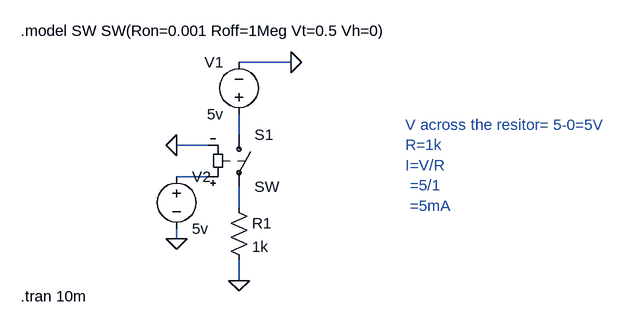
[diagram p0: schematic SW A(series).asc]
SW A(series).asc, the LTspice schematic file:
Version 4.1
SHEET 1 880 680
WIRE 288 -320 208 -320
WIRE 208 -208 208 -240
WIRE 160 -192 112 -192
WIRE 160 -144 112 -144
WIRE 208 -96 208 -128
WIRE 112 -48 112 -64
WIRE 208 16 208 -16
FLAG 288 -320 0
FLAG 208 16 0
FLAG 112 -192 0
FLAG 112 -48 0
SYMBOL voltage 208 -224 R180
WINDOW 0 24 96 Left 2
WINDOW 3 24 16 Left 2
WINDOW 123 0 0 Left 0
WINDOW 39 0 0 Left 0
SYMATTR InstName V1
SYMATTR Value 5v
SYMBOL res 192 -112 R0
SYMATTR InstName R1
SYMATTR Value 1k
SYMBOL sw 208 -224 R0
SYMATTR InstName S1
SYMBOL voltage 112 -160 R0
WINDOW 123 0 0 Left 0
WINDOW 39 0 0 Left 0
SYMATTR InstName V2
SYMATTR Value 5v
TEXT -128 -368 Left 2 !.model SW SW(Ron=0.001 Roff=1Meg Vt=0.5 Vh=0)
TEXT -128 40 Left 2 !.tran 10m
TEXT 464 -224 Left 2 ;V across the resitor= 5-0=5V\nR=1k\nI=V/R\n =5/1\n =5mA

The netlist it stands for:
* SW A(series).asc
V1 N001 0 5v
R1 N003 0 1k
S1 N001 N003 N002 0 SW
V2 N002 0 5v
.model SW SW(Ron=0.001 Roff=1Meg Vt=0.5 Vh=0)
.tran 10m
* V across the resitor= 5-0=5V
* R=1k
* I=V/R
*  =5/1
*  =5mA
.backanno
.end